# Altium schematic sheet Current sensing.SchDoc
size A
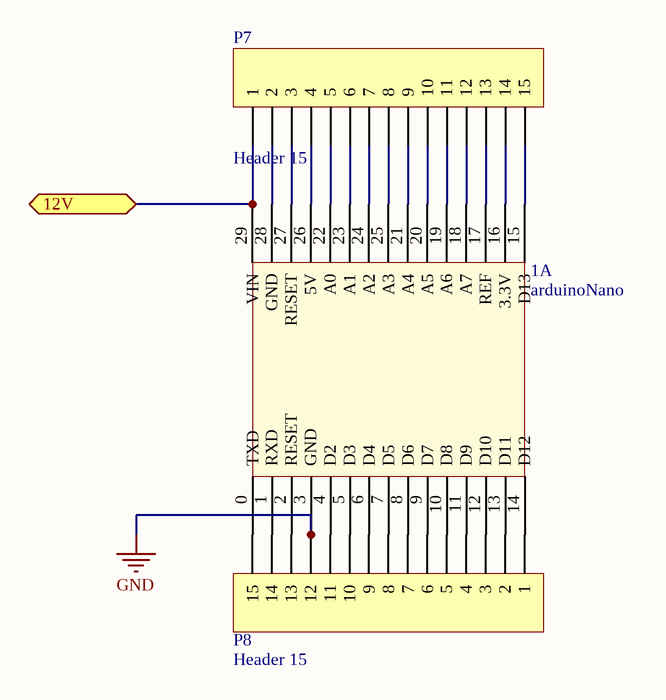
[diagram p0: Current sensing.SchDoc]

## Parts
1A  arduinoNano  [Arduino nano]
P7  Header 15  [HDR1X15]
P8  Header 15  [HDR1X15]

## Ports
12V

## Nets
GND: 1A.3(GND) P8.12
12V: 1A.29(VIN) P7.1 ; port 12V
Net1A_0: 1A.0(TXD) P8.15
Net1A_1: 1A.1(RXD) P8.14
Net1A_2: 1A.2(RESET) P8.13
Net1A_4: 1A.4(D2) P8.11
Net1A_5: 1A.5(D3) P8.10
Net1A_6: 1A.6(D4) P8.9
Net1A_7: 1A.7(D5) P8.8
Net1A_8: 1A.8(D6) P8.7
Net1A_9: 1A.9(D7) P8.6
Net1A_10: 1A.10(D8) P8.5
Net1A_11: 1A.11(D9) P8.4
Net1A_12: 1A.12(D10) P8.3
Net1A_13: 1A.13(D11) P8.2
Net1A_14: 1A.14(D12) P8.1
Net1A_15: 1A.15(D13) P7.15
Net1A_16: 1A.16(3.3V) P7.14
Net1A_17: 1A.17(REF) P7.13
Net1A_18: 1A.18(A7) P7.12
Net1A_19: 1A.19(A6) P7.11
Net1A_20: 1A.20(A5) P7.10
Net1A_21: 1A.21(A4) P7.9
Net1A_22: 1A.22(A0) P7.5
Net1A_23: 1A.23(A1) P7.6
Net1A_24: 1A.24(A2) P7.7
Net1A_25: 1A.25(A3) P7.8
Net1A_26: 1A.26(5V) P7.4
Net1A_27: 1A.27(RESET) P7.3
Net1A_28: 1A.28(GND) P7.2

## Library data of the parts
P7 P8 = Header 15: Header, 15-Pin; LatestRevisionDate: 17-Jul-2002; LatestRevisionNote: Re-released for DXP Platform.; Publisher: Altium Limited